# EAGLE schematic piezo_amp (EAGLE 7.5.0)
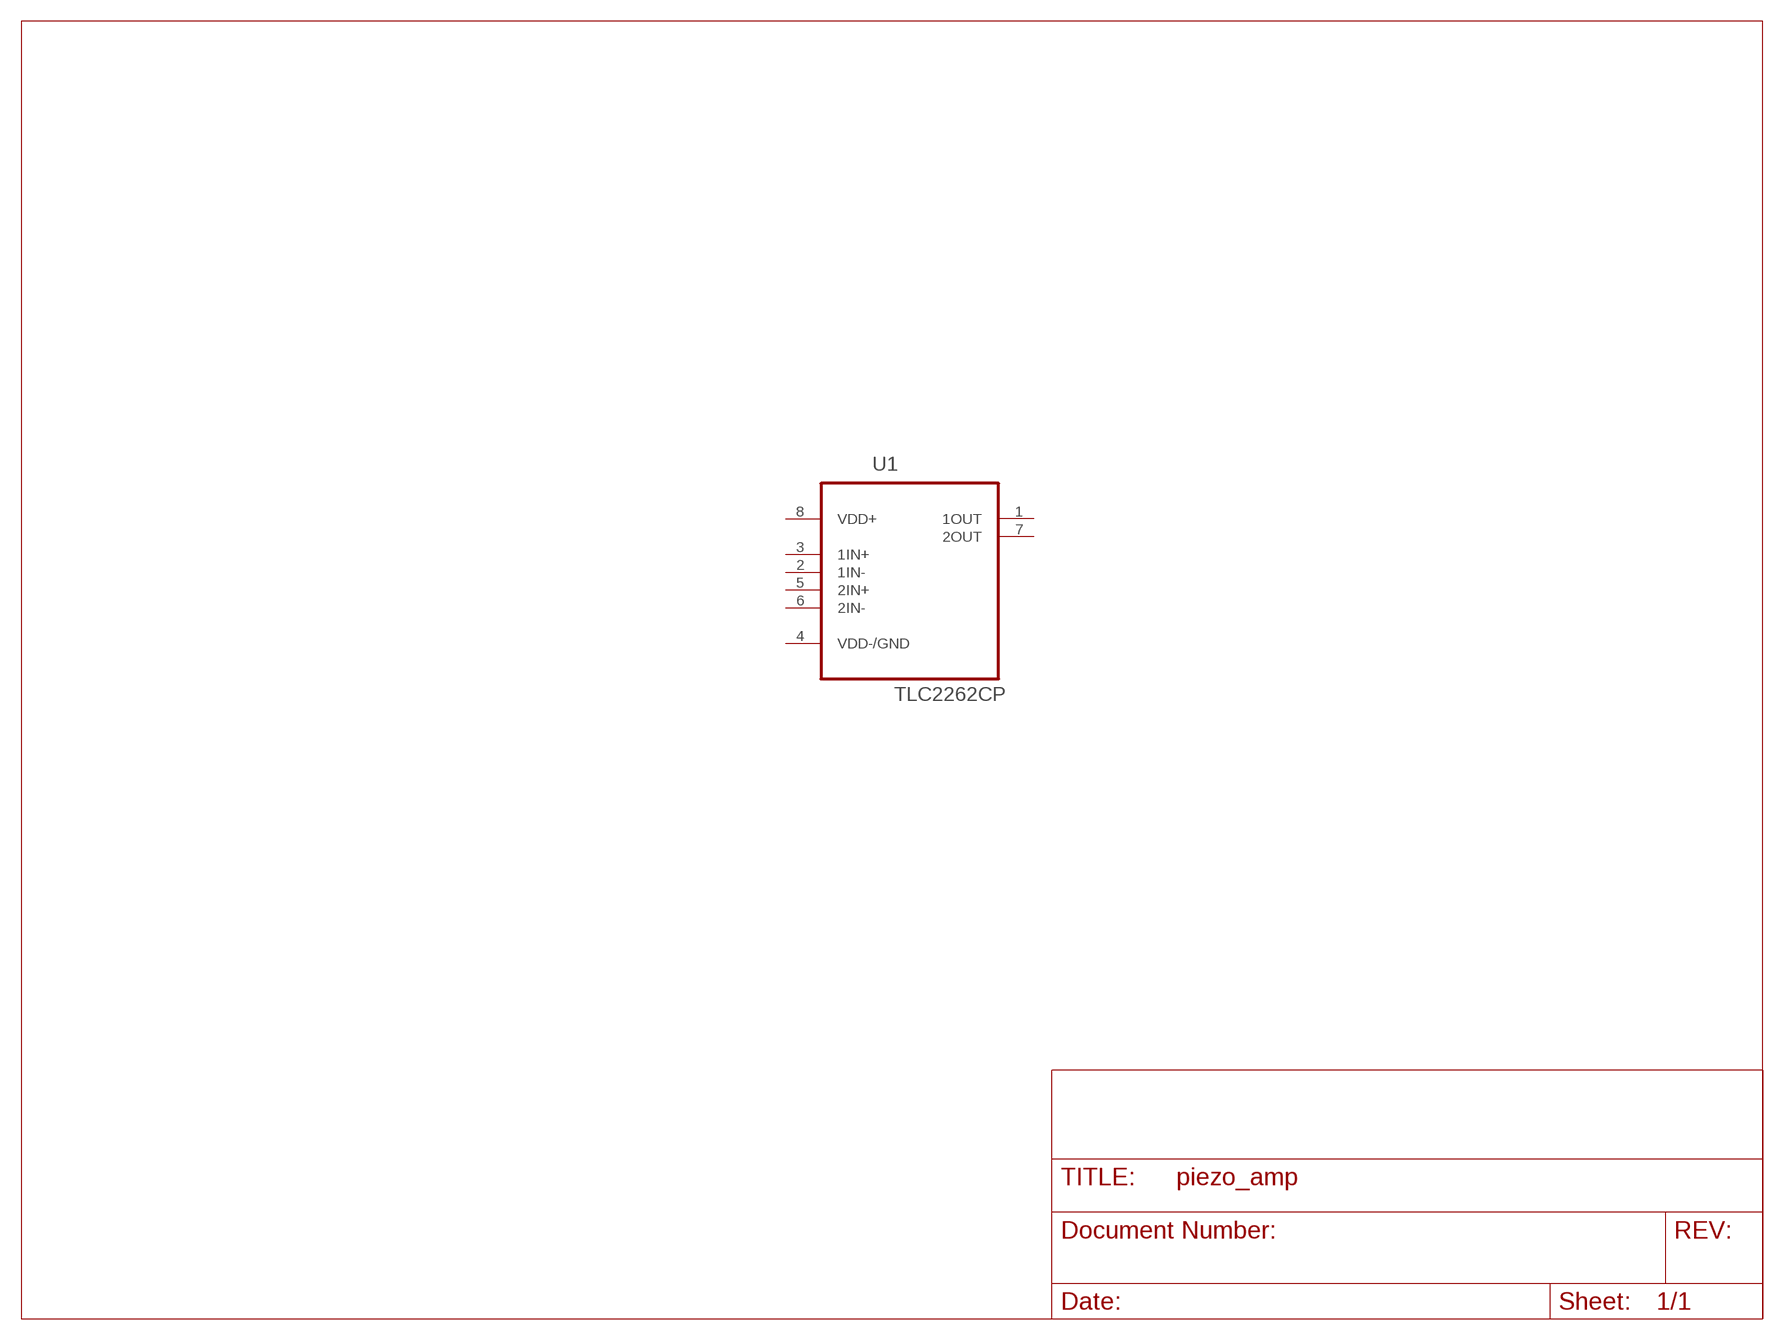
[diagram p0: schematic, sheet 1]

## Parts
U1  TLC2262CP  [DIP254P762X508-8]
Unconnected: U1.1(1OUT) U1.2(1IN-) U1.3(1IN+) U1.4(VDD-/GND) U1.5(2IN+) U1.6(2IN-) U1.7(2OUT)

## Power pins joined to a net without a drawn wire
VDD+: U1.8(VDD+)

## Library data of the parts
U1 = Texas Instruments_By_element14_Batch_1:TLC2262CP: OPERATIONAL AMPLIFIER; MPN: TLC2262CP; OC_FARNELL: 8453799; OC_NEWARK: 35K1181; PACKAGE: PDIP; SUPPLIER: Texas Instruments